# Altium schematic sheet Sheet1.SchDoc: Schematic of the Display sub system
size 381 x 241 mm
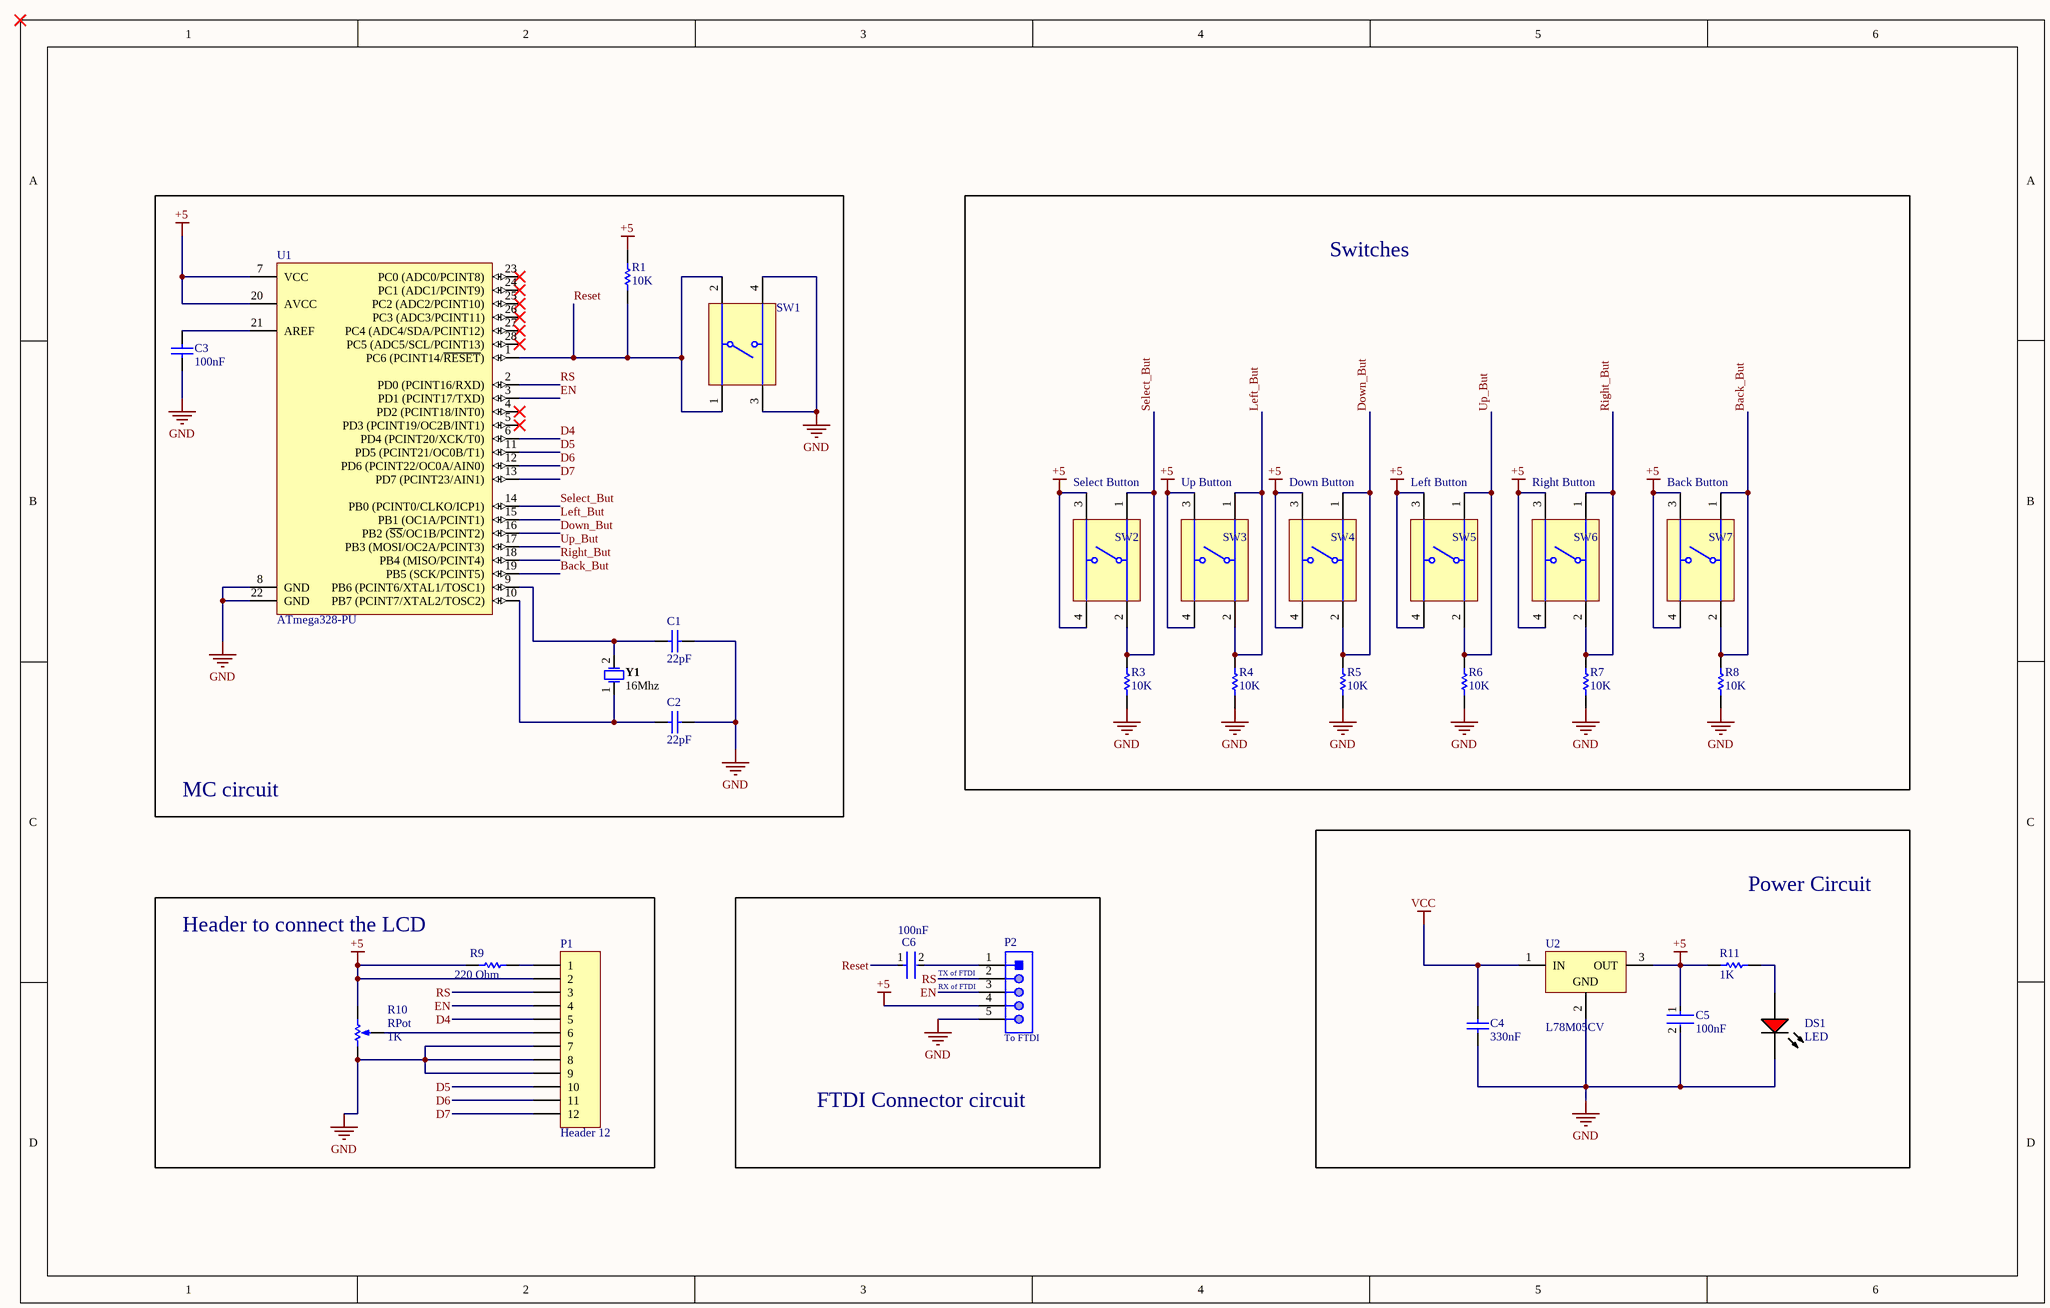
[diagram p0: Sheet1.SchDoc]

## Parts
C1  22pF  [RAD-0.3]
C2  22pF  [RAD-0.3]
C3  100nF  [RAD-0.3]
C4  330nF  [CAPC1812(4532)100_L]
C5  100nF  [FP-CGA3E-0_3-0_1-IPC_A]
C6  100nF  [FP-CGA3E-0_3-0_1-IPC_A]
DS1  LED  [INDPR60-254-520X380X650]
P1  Header 12  [HDR1X12]
P2  To FTDI  [648105131822]
R1  10K  [AXIAL-0.3]
R3  10K  [AXIAL-0.3]
R4  10K  [AXIAL-0.3]
R5  10K  [AXIAL-0.3]
R6  10K  [AXIAL-0.3]
R7  10K  [AXIAL-0.3]
R8  10K  [AXIAL-0.3]
R9  220 Ohm  [AXIAL-0.3]
R10  RPot  value 1K  [VR5]
R11  1K  [AXIAL-0.3]
SW1  (no value)  [TECO-FSM4JSMA_V]
SW2  Select Button  [TECO-FSM4JSMA_V]
SW3  Up Button  [TECO-FSM4JSMA_V]
SW4  Down Button  [TECO-FSM4JSMA_V]
SW5  Left Button  [TECO-FSM4JSMA_V]
SW6  Right Button  [TECO-FSM4JSMA_V]
SW7  Back Button  [TECO-FSM4JSMA_V]
U1  ATmega328-PU  [28P3]
U2  L78M05CV  [TO220]
Y1  16Mhz  [FOX-FOXSLF160-20]

## Blocks framed on the sheet
MC circuit: C1-C3 R1 SW1 U1 Y1
Switches: R3-R8 SW2-SW7
Power Circuit: C4 C5 DS1 R11 U2
Header to connect the LCD: P1 R9 R10
FTDI Connector circuit: C6 P2

## Nets
+5: C5.1 P1.2 P2.4 R1.2 R9.2 R10.2(BOT) R11.1 SW2.3 SW2.4 SW3.3 SW3.4 SW4.3 SW4.4 SW5.3 SW5.4 SW6.3 SW6.4 SW7.3 SW7.4 U1.7(VCC) U1.20(AVCC) U2.3(OUT)
GND: C1.2 C2.2 C3.1 C4.1 C5.2 DS1.2(K) P1.7 P1.8 P1.9 P2.5 R3.1 R4.1 R5.1 R6.1 R7.1 R8.1 R10.1(TOP) SW1.3 SW1.4 U1.8(GND) U1.22(GND) U2.2(GND)
VCC: C4.2 U2.1(IN)
Back_But: R8.2 SW7.1 SW7.2 U1.19(PB5_(SCK/PCINT5))
D4: P1.5 U1.6(PD4_(PCINT20/XCK/T0))
D5: P1.10 U1.11(PD5_(PCINT21/OC0B/T1))
D6: P1.11 U1.12(PD6_(PCINT22/OC0A/AIN0))
D7: P1.12 U1.13(PD7_(PCINT23/AIN1))
Down_But: R5.2 SW4.1 SW4.2 U1.16(PB2_(~{SS}/OC1B/PCINT2))
EN: P1.4 P2.3 U1.3(PD1_(PCINT17/TXD))
Left_But: R4.2 SW3.1 SW3.2 U1.15(PB1_(OC1A/PCINT1))
Reset: C6.1 R1.1 SW1.1 SW1.2 U1.1(PC6_(PCINT14/~{RESET}))
Right_But: R7.2 SW6.1 SW6.2 U1.18(PB4_(MISO/PCINT4))
RS: P1.3 P2.2 U1.2(PD0_(PCINT16/RXD))
Select_But: R3.2 SW2.1 SW2.2 U1.14(PB0_(PCINT0/CLKO/ICP1))
Up_But: R6.2 SW5.1 SW5.2 U1.17(PB3_(MOSI/OC2A/PCINT3))
NetC1_1: C1.1 U1.9(PB6_(PCINT6/XTAL1/TOSC1)) Y1.2
NetC2_1: C2.1 U1.10(PB7_(PCINT7/XTAL2/TOSC2)) Y1.1
NetC3_2: C3.2 U1.21(AREF)
NetC6_2: C6.2 P2.1
NetDS1_1: DS1.1(A) R11.2
NetP1_1: P1.1 R9.1
NetP1_6: P1.6 R10.3(TAP)

Not connected (* = marked no-connect by the designer): U1 4(PD2_(PCINT18/INT0))* 5(PD3_(PCINT19/OC2B/INT1))* 23(PC0_(ADC0/PCINT8))* 24(PC1_(ADC1/PCINT9))* 25(PC2_(ADC2/PCINT10))* 26(PC3_(ADC3/PCINT11))* 27(PC4_(ADC4/SDA/PCINT12))* 28(PC5_(ADC5/SCL/PCINT13))*

## Notes on the sheet
- TX of FTDI
- RX of FTDI

## Library data of the parts
C1-C3 = Cap: Capacitor; Published: 8-Jun-2000; LatestRevisionDate: 17-Jul-2002; LatestRevisionNote: Re-released for DXP Platform.; PackageReference: RAD-0.3; Publisher: Altium Limited; PackageDescription: Radial Cap, Thru-Hole; 2 Leads; 0.3 in Pin Spacing
  C1 C2: Value: 22pF
  C3: Value: 100nF
C4 = CMP-1040-01492-1: CAP 330nF 50V ±10% 1812 (4532 Metric) Thickness 1mm SMD; Tolerance: Â±10%; Case-Metric: 4532; Case-EIA: 1812; Value: 330nF; Technology: SMT; Rated Voltage: 50 V; Max Thickness: 1 mm
C5 C6 = CMP-2000-07546-2: Cap Ceramic 100nF 50V X7R 10% Pad SMD 0603 +125°C Automotive T/R; Weight: 7.1E-05oz; Composition: Ceramic; Max Operating Temperature: 125°C; Termination: SMD/SMT; Dielectric: X7R; Length: 1.6mm; Package Quantity: 1; REACH SVHC: No SVHC; Lead Free: Lead Free; Case Code (Metric): 1608; Min Operating Temperature: -55°C; Packaging: Tape and Reel; Tolerance: 10%; Voltage Rating: 50V; Case Code (Imperial): 0603; Capacitance: 100nF; Case/Package: 0603; Voltage Rating (DC): 50V; Depth: 0.8mm; Radiation Hardening: No; Ratings: AEC-Q200; Mount: Surface Mount; Voltage: 50V; Thickness: 0.035inch; Width: 0.8mm; Height: 0.8mm
DS1 = CMP-1674-00005-1: Radial LED, 12.6 mcd, 20 mA, 2 V, -55 to 100 degC, 2-Pin THD, RoHS, Bulk; Shielding: Unshielded; Resistance: 0.045 Ohm; Current Rating: 3.6 A; Tolerance: 20%; PackageReference: LTL-1CHE; PackageDescription: 2-Pin Through Hole Device, Dia 3.8 mm, Pitch 2.54 mm; Case\Package: Radial; Length: 0.97 inch; Width: 0.62 inch; Height: 1.1 inch; Radiation Hardening: No; Lead Pitch: 11.44 mm; ComponentLink1URL: http://www.us.liteon.com/; ComponentLink1Description: Manufacturer URL; RoHSCompliant: true; Packaging: Tray; Mount: Through Hole; Min Operating Temperature: -40 degC; Max Operating Temperature: 130 degC; ComponentLink2URL: https://datasheet.ciiva.com/15117/getdatasheetpartid-187746-15117985.pdf; Package Quantity: 55; ComponentLink2Description: Datasheet; DatasheetVersion: Dec-03
P1 = Header 12: Header, 12-Pin; LatestRevisionDate: 17-Jul-2002; LatestRevisionNote: Re-released for DXP Platform.; Publisher: Altium Limited
P2 = CMP-1502-00733-1: Male Shrouded Header WR-WTB, SMT, Right Angled, pitch 1.5 mm, 1 x 5 position; Manufacturer: Wurth Elektronik; Pitch: 1.5mm; Position: 1x5; Contact Resistance: 20mOhm; Working Voltage: 50VAC; Gender: Male; Publisher: WurthElektronik; Package Reference: 648105131822; Orientation: RightAngled; Mounting Technology: SMT; Manufacturer URL: http://www.we-online.de; Datasheet URL: https://katalog.we-online.de/em/datasheet/6481xx131822.pdf; Packaging: TapeandReel; Operating Temperature: -25to85degC; Part Number: 648105131822
R1 R3-R9 R11 = Res1: Resistor; Published: 8-Jun-2000; LatestRevisionDate: 17-Jul-2002; LatestRevisionNote: Re-released for DXP Platform.; PackageReference: AXIAL-0.3; Publisher: Altium Limited; PackageDescription: Axial Device, Thru-Hole; 2 Leads; 0.3 in Pin Spacing
  R1 R3-R8: Value: 10K
  R9: Value: 220 Ohm
  R11: Value: 1K
R10 = RPot: Potentiometer; Sim Note: Enter the Resistance value and the set point into parameter fields.; Set Position: 0.5; Published: 8-Jun-2000; LatestRevisionDate: 17-Jul-2002; LatestRevisionNote: Re-released for DXP Platform.; PackageReference: VR5; Publisher: Altium Limited; PackageDescription: Variable Resistor, Thru-Hole; 3 Leads
SW1-SW7 = CMP-2000-05602-2: Swicth, SPST, 24 V, -35 to 85 degC, 4-Pin SMD, RoHS, Tape and Reel; Manufacturer: TE Connectivity; Switch Travel: 0.25mm; Mechanical Life: 100000Cycles; Contact Current Rating: 50mA; Operating Force: 1.57N; Actuator Material: Polyamide; Contact Resistance: 100mOhm; Voltage Rating: 24V; Illumination Type: Illuminated; Actuator Length: 0.055inch; Max Voltage Rating (DC): 12V; Case\/Package: SMD/SMT; Orientation: Straight; Datasheet URL: http://www.te.com/commerce/DocumentDelivery/DDEController?Action=showdoc&DocId=Customer+Drawing%7F2-1437565-7%7FV%7Fpdf%7FEnglish%7FENG_CD_2-1437565-7_V.pdf%7F4-1437565-2; Min Operating Temperature: -35degC; Packaging: LoosePiece; Termination: GullWing; Throw Configuration: SPST; Package Description: 4-Pin Surface Mount Device, Body 6 x 6 mm, Pitch 4.5 mm; Mounting Technology: SurfaceMount; Contact Plating: Silver; Datasheet Version: Rev. V, 02/2015; RoHSCompliant: true; Max Operating Temperature: 85degC; Length: 6mm; Voltage Rating (DC): 24V; Electrical Life: 100000Cycles; Current Rating: 50mA; Package Quantity: 750; Mount: SurfaceMount; Package Reference: FSM4JSMA; Manufacturer URL: http://www.te.com/; Width: 6mm; REACH SVHC: Unknown; Contact Material: CopperAlloy
U1 = CMP-0095-00015-2: 8-bit AVR Microcontroller, 32KB Flash, 1KB EEPROM, 2KB SRAM, 28-pin PDIP, Industrial Grade (-40°C to 85°C); ComponentLink3Description: ATmega48A/48PA/88A/88PA/168A/168PA/328/328P Summary; RevisionNote: DatasheetVersion updated. URLs added.; DatasheetVersion: revD, May-2011; ComponentLink1URL: http://www.atmel.com/; PackageVersion: revB, Sep-2001; PackageDescription: 28-lead (0.300"/7.62mm Wide) Plastic Dual Inline Package (PDIP); PackageReference: 28P3; ComponentLink1Description: Manufacturer URL; ComponentLink2Description: ATmega48A/48PA/88A/88PA/168A/168PA/328/328P Datasheet; ComponentLink3URL: http://www.atmel.com/dyn/resources/prod_documents/8271S.pdf; ComponentLink2URL: http://www.atmel.com/dyn/resources/prod_documents/8271.pdf
U2 = CMP-0244-00437-1: Positive Voltage Regulator, 5V, 3-Pin TO-220; ComponentLink1Description: Manufacturer URL; PackageReference: TO220; ComponentLink1URL: http://www.st.com; PackageVersion: ver3.0; ComponentLink3Description: Package Specification; ComponentLink2URL: http://www.st.com/internet/com/TECHNICAL_RESOURCES/TECHNICAL_LITERATURE/DATASHEET/CD00000447.pdf; PackageDescription: TO, Thru-Hole, Vertical, Heatsink Mounted; 3 In-Line Leads; Pitch 2.54 mm; DatasheetVersion: 1/11/2010; ComponentLink3URL: http://www.st.com/internet/com/TECHNICAL_RESOURCES/TECHNICAL_LITERATURE/PACKAGE_INFORMATION/CD00004649.pdf; ComponentLink2Description: Datasheet
Y1 = CMP-1749-00003-1: Resistance Weld Thru-Hole Crystal, 16 MHz, -20 to 70 degC, 2-Pin THD, RoHS, Bulk; Voltage Rating: 250 V; Tolerance: 1%; Resistance: 221 kohm; Case\Package: Axial; Power Rating: 250 mW; RoHSCompliant: true; Package Quantity: 200; Packaging: Bulk; Min Operating Temperature: -55 degC; DatasheetVersion: Mar-15; ComponentLink1URL: http://www.foxonline.com/; Max Operating Temperature: 155 degC; PackageReference: FOXSLF160-20; Mount: Through Hole; PackageDescription: 2-Pin Through Hole Device, Body 11.35 x 4.65 mm; ComponentLink1Description: Manufacturer URL; ComponentLink2URL: http://www.foxonline.com/pdfs/hc49slf.pdf; ComponentLink2Description: Datasheet; Length: 0.248 inch